# EAGLE design ESP_SIM7000V1.62 (EAGLE 9.6.2)
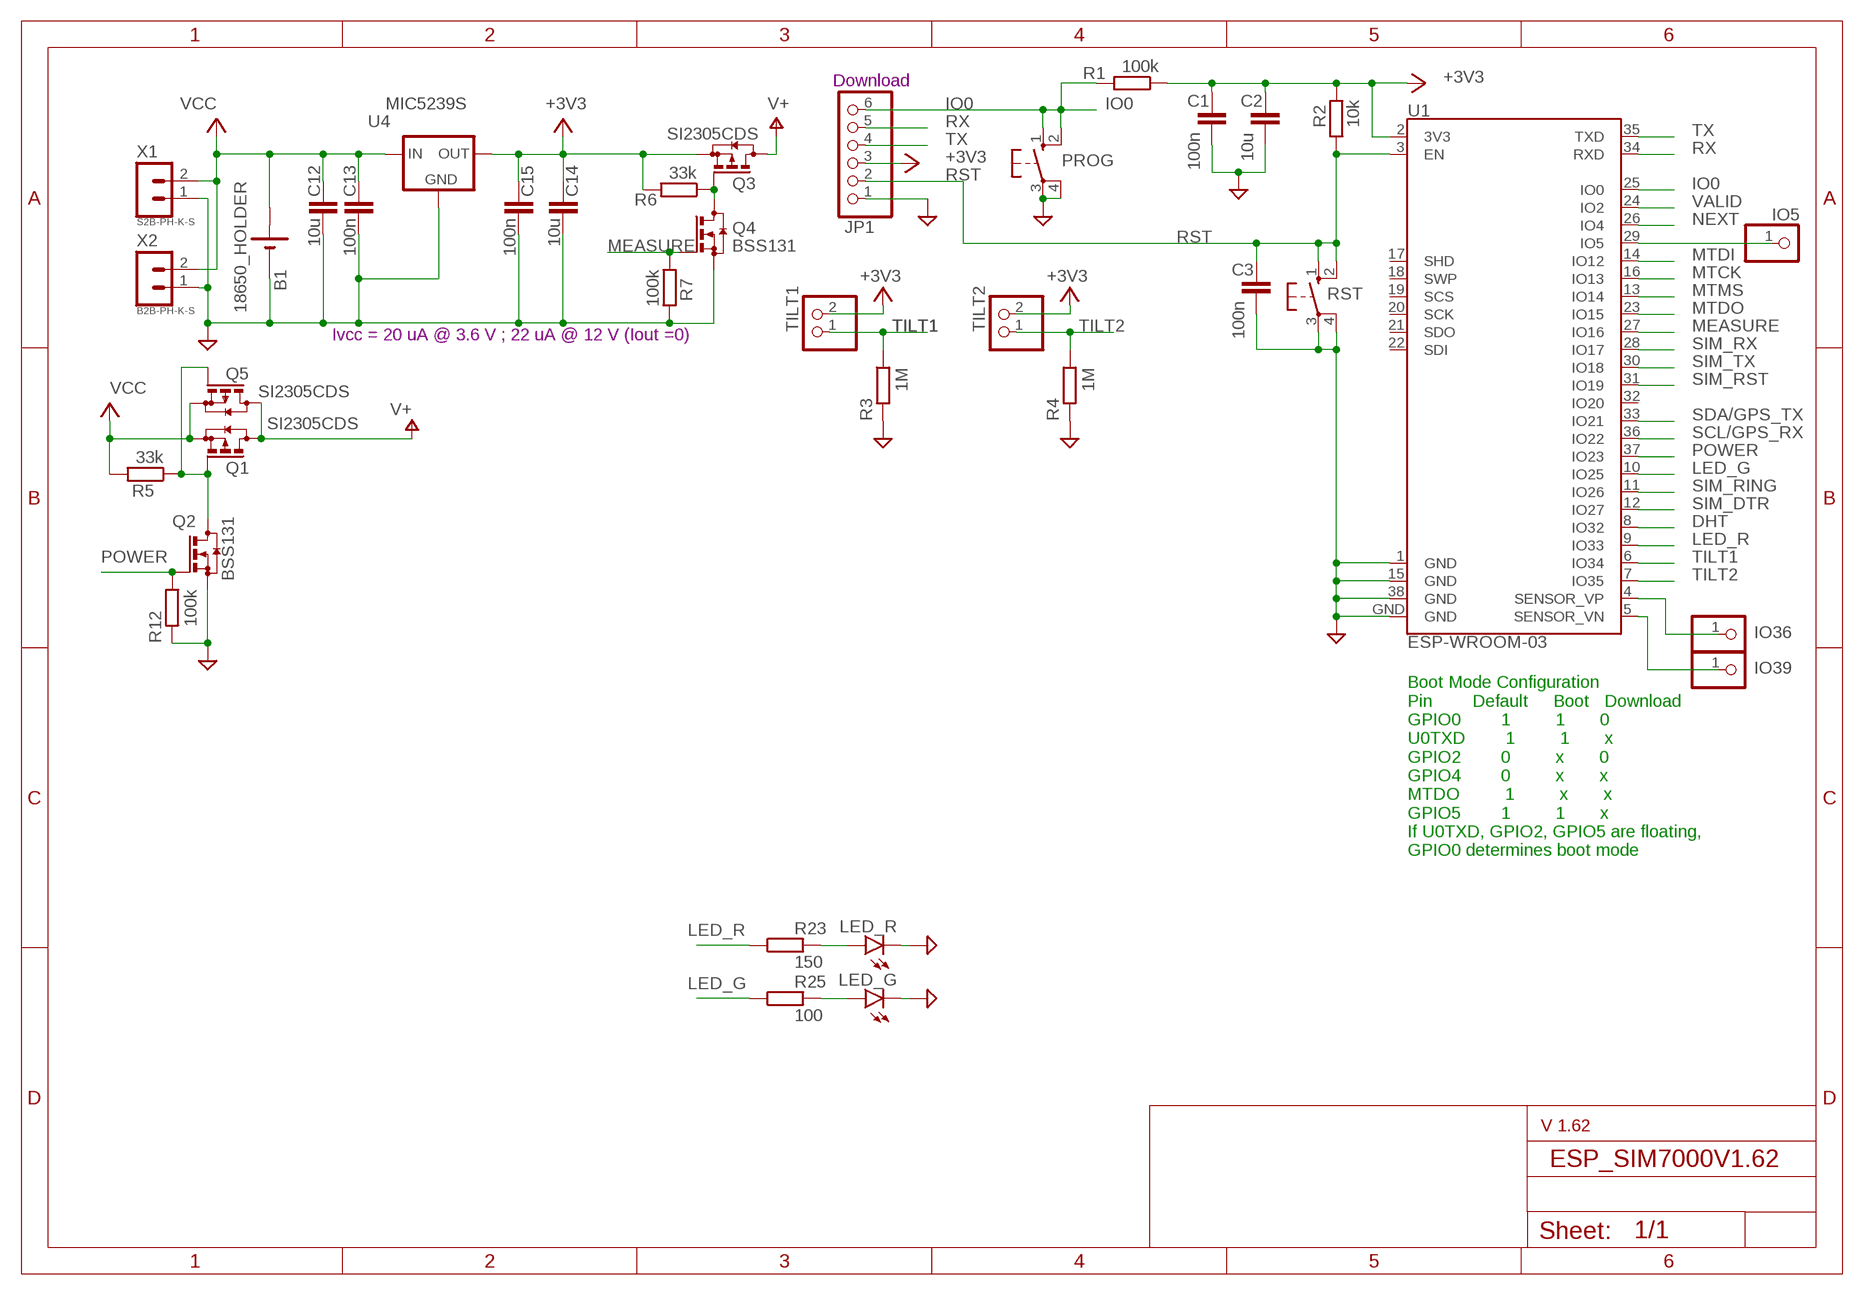
[diagram p0: schematic, sheet 1]

## Parts
B1  18650_HOLDER  [18650]
C1  100n  CC1206  [C1206]
C2  10u  CC1210  [C1210]
C3  100n  CC1206  [C1206]
C12  10u  CC1210  [C1210]
C13  100n  CC1206  [C1206]
C14  10u  CC1210  [C1210]
C15  100n  CC1206  [C1206]
IO5  PINHD-1X1  [1X01]
IO36  PINHD-1X1  [1X01]
IO39  PINHD-1X1  [1X01]
JP1  PINHD-1X6  [1X06]
LED_G  LEDSMT1206  [1206]
LED_R  LEDSMT1206  [1206]
PROG  10-XX  [B3F-10XX]
Q1  SI2305CDS  [SOT23]
Q2  BSS131  [SOT23]
Q3  SI2305CDS  [SOT23]
Q4  BSS131  [SOT23]
Q5  SI2305CDS  [SOT23]
R1  100k  RR1206  [R1206]
R2  10k  RR1206  [R1206]
R3  1M  RR1206  [R1206]
R4  1M  RR1206  [R1206]
R5  33k  RR1206  [R1206]
R6  33k  RR1206  [R1206]
R7  100k  RR1206  [R1206]
R12  100k  RR1206  [R1206]
R23  150  RR1206  [R1206]
R25  100  RR1206  [R1206]
RST  10-XX  [B3F-10XX]
TILT1  PINHD-1X2  [1X02]
TILT2  PINHD-1X2  [1X02]
U1  ESP-WROOM-03  [ESP-WROOM-03]
U4  MIC5239S  [SOT223]
X1  S2B-PH-K-S  [S2B-PH-K-S]
X2  B2B-PH-K-S  [B2B-PH-K-S]

## Nets
+3V3: C1.1 C2.1 C14.1 C15.1 JP1.3 Q3.2(S) R1.1 R2.2 R6.2 TILT1.2 TILT2.2 U1.2(3V3) U4.3(OUT)
DHT: U1.8(IO32)
GND: B1.- C1.2 C2.2 C3.2 C12.2 C13.2 C14.2 C15.2 JP1.1 LED_G.C LED_R.C PROG.3(P) PROG.4(P1) Q2.2(S) Q4.2(S) R3.2 R4.2 R7.2 R12.2 RST.3(P) RST.4(P1) U1.1(GND) U1.15(GND) U1.38(GND) U1.GND U4.2(GND) U4.4(GND) X1.1 X2.1
IO0: JP1.6 PROG.1(S) PROG.2(S1) R1.2 U1.25(IO0)
IO36: IO36.1 U1.4(SENSOR_VP)
IO39: IO39.1 U1.5(SENSOR_VN)
LED_G: R25.1 U1.10(IO25)
LED_R: R23.1 U1.9(IO33)
MEASURE: Q4.1(G) R7.1 U1.27(IO16)
MTCK: U1.16(IO13)
MTDI: U1.14(IO12)
MTDO: U1.23(IO15)
MTMS: U1.13(IO14)
N$1: Q1.1(G) Q2.3(D) Q5.1(G) R5.1
N$2: Q3.1(G) Q4.3(D) R6.1
N$7: LED_R.A R23.2
N$8: LED_G.A R25.2
N$17: IO5.1 U1.29(IO5)
NEXT: U1.26(IO4)
POWER: Q2.1(G) R12.1 U1.37(IO23)
RST: C3.1 JP1.2 R2.1 RST.1(S) RST.2(S1) U1.3(EN)
RX: JP1.5 U1.34(RXD)
SCL/GPS_RX: U1.36(IO22)
SDA/GPS_TX: U1.33(IO21)
SIM_DTR: U1.12(IO27)
SIM_RING: U1.11(IO26)
SIM_RST: U1.31(IO19)
SIM_RX: U1.28(IO17)
SIM_TX: U1.30(IO18)
TILT1: R3.1 TILT1.1 U1.6(IO34)
TILT2: R4.1 TILT2.1 U1.7(IO35)
TX: JP1.4 U1.35(TXD)
V+: Q1.3(D) Q3.3(D) Q5.3(D)
VALID: U1.24(IO2)
VCC: B1.+ C12.1 C13.1 Q1.2(S) Q5.2(S) R5.2 U4.1(IN) X1.2 X2.2
Unconnected: U1.17(SHD) U1.18(SWP) U1.19(SCS) U1.20(SCK) U1.21(SDO) U1.22(SDI) U1.32(IO20)

## Notes on the sheet
- Download
- Ivcc = 20 uA @ 3.6 V ; 22 uA @ 12 V (Iout =0)
- Boot Mode Configuration
  Pin        Default     Boot   Download
  GPIO0        1         1       0
  U0TXD        1         1       x
  GPIO2        0         x       0
  GPIO4        0         x       x
  MTDO         1         x       x
  GPIO5        1         1       x
  If U0TXD, GPIO2, GPIO5 are floating, 
  GPIO0 determines boot mode
- V 1.62

## Library data of the parts
B1 = battery_bms:18650_HOLDER: 18650 holder
C1-C3 C12-C15 = eagle-ltspice:C: CAPACITOR, European symbol; SPICEMODEL: NONE; SPICEPREFIX: C
IO5 IO36 IO39 = pinhead:PINHD-1X1: PIN HEADER
JP1 = pinhead:PINHD-1X6: PIN HEADER
LED_G LED_R = led:LED: LED OSRAM: - CHIPLED LG R971, LG N971, LY N971, LG Q971, LY Q971, LO R971, LY R971 LH N974, LH R974 LS Q976, LO Q976, LY Q976 LO Q996 - Hyper CHIPLED LW Q18S LB Q993, LB Q99A, LB R99A - SideLED LS A670, LO A670, LY A670, LG A670, LP A670 LB A673, LV A673, LT A673, LW A673 LH A674 LY A675 LS A676, LA A676, LO A676, LY A676, LW A676 LS A679, LY A679, LG A679 - Hyper Micro SIDELED® LS Y876, LA Y876, LO Y876, LY Y876 LT Y87S - SmartLED LW L88C, LW L88S LB L89C, LB L89S, LG L890 LS L89K, LO L89K, LY L89K LS L896, LA L896, LO L896, LY L896 - TOPLED LS T670, LO T670, LY T670, LG T670, LP T670 LSG T670, LSP T670, LSY T670, LOP T670, LYG T670 LG T671, LOG T671, LSG T671 LB T673, LV T673, LT T673, LW T673 LH T674 LS T676, LA T676, LO T676, LY T676, LB T676, LH T676, LSB T676, LW T676 LB T67C, LV T67C, LT T67C, LS T67K, LO T67K, LY T67K, LW E67C LS E67B, LA E67B, LO E67B, LY E67B, LB E67C, LV E67C, LT E67C LW T67C LS T679, LY T679, LG T679 LS T770, LO T770, LY T770, LG T770, LP T770 LB T773, LV T773, LT T773, LW T773 LH T774 LS E675, LA E675, LY E675, LS T675 LS T776, LA T776, LO T776, LY T776, LB T776 LHGB T686 LT T68C, LB T68C - Hyper Mini TOPLED® LB M676 - Mini TOPLED Santana® LG M470 LS M47K, LO M47K, LY M47K Source: http://www.osram.convergy.de LUXEON: - LUMILED® LXK2-PW12-R00, LXK2-PW12-S00, LXK2-PW14-U00, LXK2-PW14-V00 LXK2-PM12-R00, LXK2-PM12-S00, LXK2-PM14-U00 LXK2-PE12-Q00, LXK2-PE12-R00, LXK2-PE12-S00, LXK2-PE14-T00, LXK2-PE14-U00 LXK2-PB12-K00, LXK2-PB12-L00, LXK2-PB12-M00, LXK2-PB14-N00, LXK2-PB14-P00, LXK2-PB14-Q00 LXK2-PR12-L00, LXK2-PR12-M00, LXK2-PR14-Q00, LXK2-PR14-R00 LXK2-PD12-Q00, LXK2-PD12-R00, LXK2-PD12-S00 LXK2-PH12-R00, LXK2-PH12-S00 LXK2-PL12-P00, LXK2-PL12-Q00, LXK2-PL12-R00 Source: www.luxeon.com KINGBRIGHT: KA-3528ASYC Source: www.kingbright.com
PROG RST = switch-omron:10-XX: OMRON SWITCH; MPN: B3F-1000; OC_FARNELL: 176432; OC_NEWARK: 36M3542
Q1 Q3 Q5 = transistor-small-signal-perso:SI2305CDS: P-CHANNEL MOS FET
Q2 Q4 = transistor-small-signal-perso:BSS131: N-CHANNEL MOS FET
R1-R7 R12 R23 R25 = eagle-ltspice:R: RESISTOR, European symbol; SPICEMODEL: NONE; SPICEPREFIX: R
TILT1 TILT2 = pinhead:PINHD-1X2: PIN HEADER
U1 = esp32-sparkfun (1):ESP-WROOM-03; OC_FARNELL: unknown
U4 = micrel:MIC5239S: LDO REGULATOR
X1 = con-JST PH:S2B-PH: JST PH series header 2.00mm pitch disconnectable crimp style connectors, horizontal (side entry type), 2 pins
X2 = con-JST PH:B2B-PH: JST PH series header 2.00mm pitch disconnectable crimp style connectors, vertical (side entry type), 2 pins

## Board
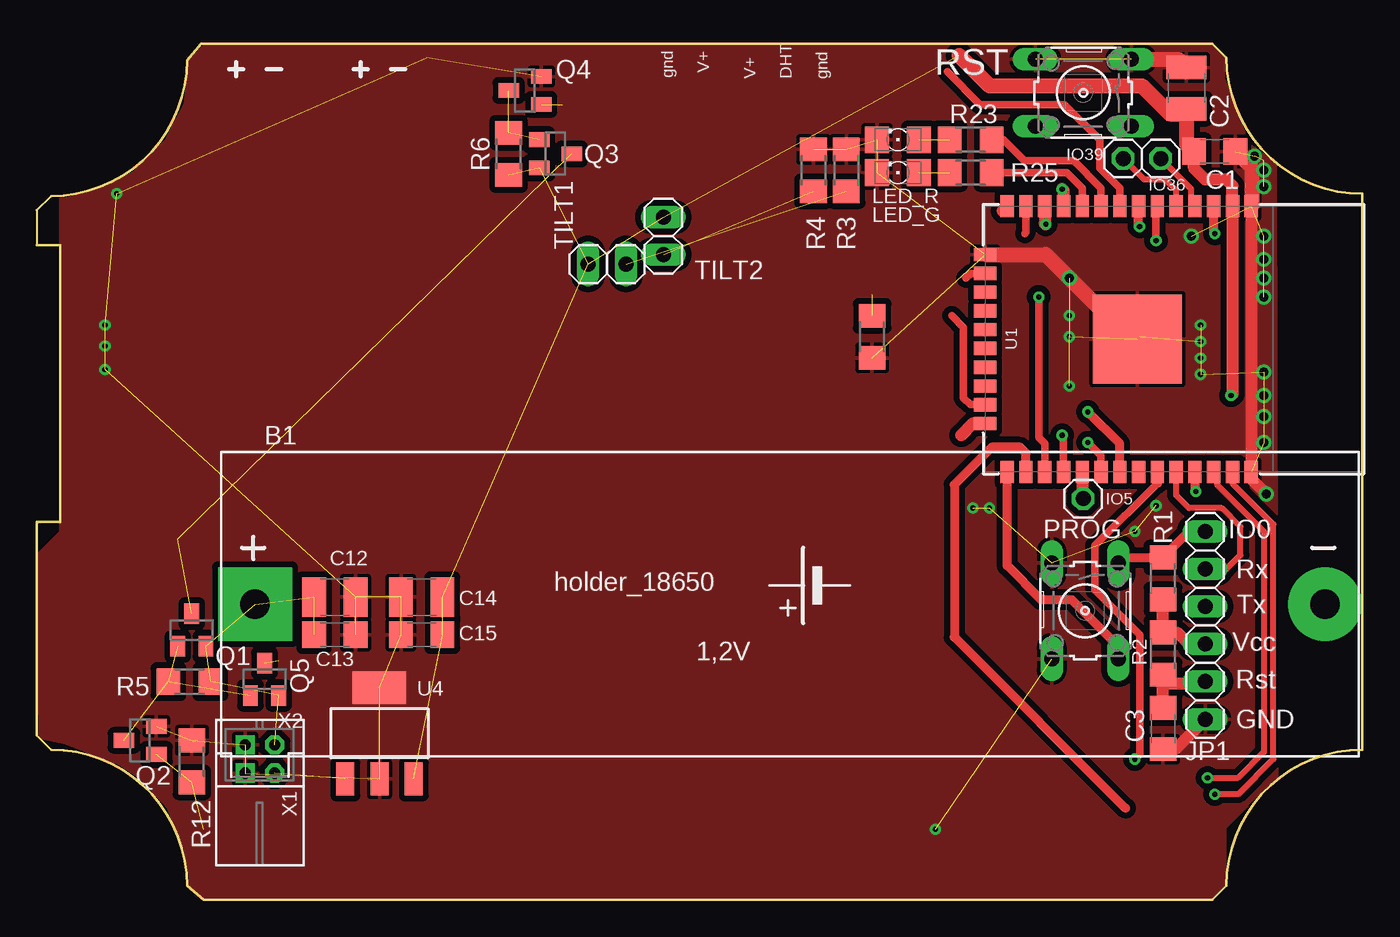
[diagram p1: board, top side]
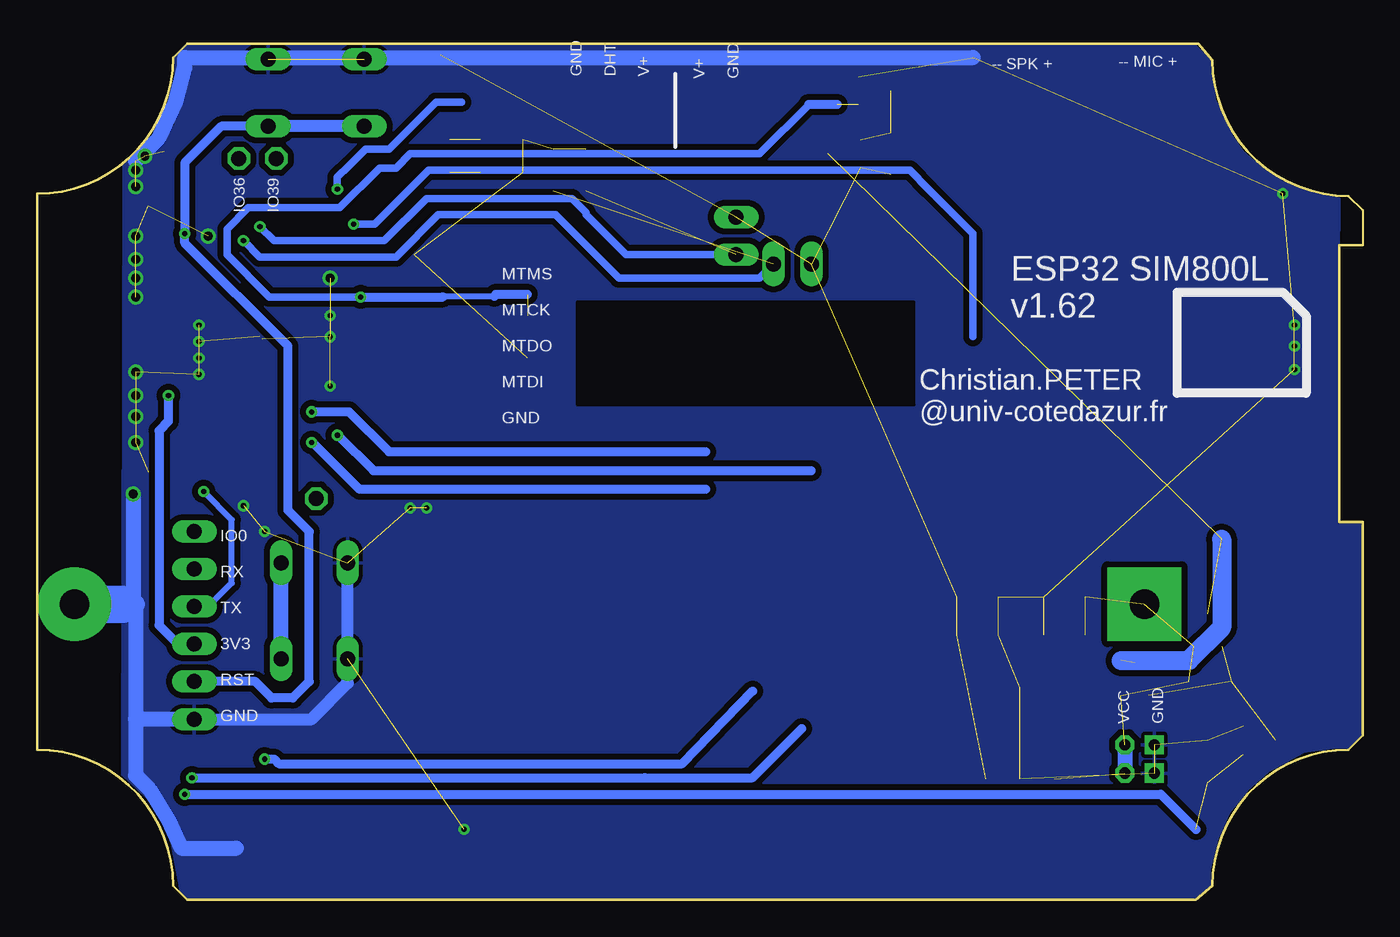
[diagram p2: board, bottom side, seen from below]

Size 89.69 x 57.94 mm. Coordinates in mm from the lower left corner, seen from the top.
Outline: 0.95,10.16 arc-90 10.16,0.95
Outline: 10.16,0.95 11.27,0 79.53,0 80.49,0.95 arc-90 89.69,10.16 89.69,47.78 arc-90 80.49,56.99 79.53,57.94 11.11,57.94 10.16,56.83 arc-90 0.95,47.62 0,46.67 0,44.29 1.59,44.29 1.59,25.56 0,25.56 0,11.11 0.95,10.16
Outline: 0.95,10.16 arc-90 10.16,0.95
Copper layers (1*16): Top 0.035mm / dielectric 1.5mm / Bottom 0.035mm
Design rules "default *": minimum track width 6mil, minimum drill 0.35mm, track to track 6mil, track to pad 6mil, pad to pad 6mil, via to via 6mil, smd to smd 6mil, copper to edge 0mil, drill to drill 6mil, minimum pad ring 10mil, minimum via ring 8mil, stop-mask expansion 4mil, vias tented up to drill 0mil, thermal gap 10mil

### Footprints (pad centres in the part's own frame; a part is rotated, then mirrored left to right if it is on the bottom)
18650 = drill 2 pad 5 square: + -36.2,0 | drill 2 pad 5: - 36.2,0
C1206 = smd 1.6 x 1.8: 1 -1.4,0; 2 1.4,0
C1210 = smd 1.6 x 2.7: 1 -1.4,0; 2 1.4,0
1X01 = drill 1.016 octagon: 1 0,0
1X06 = drill 1.016 long: 1 -6.35,0; 2 -3.81,0; 3 -1.27,0; 4 1.27,0; 5 3.81,0; 6 6.35,0
1206 = smd 1.6 x 1.803: A -1.422,0; C 1.422,0
B3F-10XX = drill 1.016 long: 1 -3.251,2.261; 2 3.251,2.261; 3 -3.251,-2.261; 4 3.251,-2.261
SOT23 = smd 1 x 1.4: 1 -0.95,-1.1; 2 0.95,-1.1; 3 0,1.1
R1206 = smd 1.6 x 1.803: 1 -1.422,0; 2 1.422,0
1X02 = drill 1.016 long: 1 -1.27,0; 2 1.27,0
ESP-WROOM-03 = smd 0.9 x 1.5: 1 7.7,9; 2 6.43,9; 3 5.16,9; 4 3.89,9; 5 2.62,9; 6 1.35,9; 7 0.08,9; 8 -1.19,9; 9 -2.46,9; 10 -3.73,9; 11 -5,9; 12 -6.27,9; 13 -7.54,9; 14 -8.81,9; 25 -8.81,-9; 26 -7.54,-9; 27 -6.27,-9; 28 -5,-9; 29 -3.73,-9; 30 -2.46,-9; 31 -1.19,-9; 32 0.08,-9; 33 1.35,-9; 34 2.62,-9; 35 3.89,-9; 36 5.16,-9; 37 6.43,-9; 38 7.7,-9 | smd 1.5 x 0.9: 15 -10.3,5.715; 16 -10.3,4.445; 17 -10.3,3.175; 18 -10.3,1.905; 19 -10.3,0.635; 20 -10.3,-0.635; 21 -10.3,-1.905; 22 -10.3,-3.175; 23 -10.3,-4.445; 24 -10.3,-5.715 | smd 6 x 6: GND 0,0
SOT223 = smd 1.219 x 2.235: 1 -2.311,-3.099; 2 0,-3.099; 3 2.311,-3.099 | smd 3.6 x 2.2: 4 0,3.099
S2B-PH-K-S = drill 0.75 pad 1.3 square: 1 1,0 | drill 0.75 pad 1.3 octagon: 2 -1,0
B2B-PH-K-S = drill 0.75 pad 1.3 square: 1 1,0 | drill 0.75 pad 1.3 octagon: 2 -1,0

### Placement (x,y rotation side)
B1  50.96,20 0 top
C1  79.69,50.64 0 top
C2  77.79,54.93 90 top
C3  76.2,11.59 270 top
C12  20.16,20.48 0 top
C13  20.16,17.94 0 top
C14  26.04,20.48 180 top
C15  26.04,17.94 180 top
IO5  70.8,27.15 0 top
IO36  76.04,50.16 0 top
IO39  73.5,50.16 90 top
JP1  79.06,18.57 90 top
LED_G  58.26,49.21 180 top
LED_R  58.26,51.44 180 top
PROG  70.93,19.56 270 top
Q1  10.48,18.26 0 top
Q2  6.98,10.79 90 top
Q3  35.08,50.48 270 top
Q4  33.02,54.77 90 top
Q5  15.4,14.92 0 top
R1  76.2,21.75 90 top
R2  76.2,16.67 90 top
R3  54.77,49.37 90 top
R4  52.55,49.37 90 top
R5  10.32,14.76 0 top
R6  31.91,50.48 270 top
R7  56.52,38.1 270 top
R12  10.48,9.37 90 top
R23  63.18,51.44 180 top
R25  63.18,49.21 180 top
RST  70.8,54.61 180 top
TILT1  38.58,43.02 180 top
TILT2  42.39,44.93 90 top
U1  74.46,37.95 0 top
U4  23.18,11.27 0 top
X1  15.08,8.57 180 top
X2  15.08,10.48 180 top

### Tracks (layer width: path | path; a pad name or v marks a point on that pad's centre or on a via)
+3V3  (via drill 0.35)  (7 unrouted)
  Top 0.813: JP1.3 77.95,17.3 77.16,18.09 R2.2 R1.1 | C1.1 78.29,49.5 79.06,48.74 80.49,48.74 80.89,48.33 U1.2 80.89,34.22 v80.8,34.13
  Top 1.016: 62.39,57.15 64.45,55.09 74.77,55.09 76.68,53.18 77.44,53.18 C2.1 77.79,51.15 C1.1
  Bottom 0.61: JP1.3 80.17,17.3 81.44,18.57 81.44,31.75 80.8,32.38 v80.8,34.13
DHT
  Top 0.508: U1.8 73.27,48.17 71.91,49.53 71.91,51.44 69.53,53.82 63.82,53.82 61.6,56.04
GND  (via drill 0.35, 0.6)  (48 unrouted)
  Top 0.61: U1.GND 74.62,38.1
  Top 0.813: v83.19,27.46 82.16,28.49 U1.38 U1.1 82.21,46.99 82.23,46.99 | C3.2 77.02,10.19 JP1.1
  Top 1.016: U1.15 68.26,43.66 73.82,38.1 74.31,38.1 U1.GND | 82.23,46.99 82.23,49.5 C1.2 | RST.3 77.24,56.87 C2.2
  Bottom 0.813: RST.3 74.17,56.99 | JP1.1 71.12,12.22 68.67,14.67 PROG.4 PROG.3
  Bottom 1.016: v83.19,27.46 83.19,20 | 83.03,20 83.03,12.22 | 83.03,12.22 83.03,8.41 82.07,7.46 80.8,5.4 79.94,3.49 76.2,3.49 | 83.03,50.01 81.44,51.59 80.33,53.97 79.69,56.3 79.69,56.99 67.67,56.99 RST.4 67.43,56.99 53.18,56.99 42.55,56.99 26.35,56.99 | JP1.1 83.03,12.22
  Bottom 1.27: 83.98,20 83.19,20 83.03,20
  Bottom 2.54: B1.- 83.98,20
  other vias: 83.03,43.34 83.03,35.72 83.03,42.07 83.03,30.96 83.03,44.93 83.03,40.8 83.03,34.13 83.03,32.7 69.85,42.07 4.6,35.88 4.6,37.47 4.6,38.89 69.85,39.53 69.85,38.1 69.85,34.77 5.4,47.78 64.45,26.51 63.34,26.51 60.8,4.76 83.03,48.26 78.11,44.93 82.39,50.32 83.03,49.37 74.3,24.92 75.72,26.67 78.74,38.89 78.74,37.78 78.74,36.67 78.74,35.56
  pour Top (isolate 0.406): 11.27,0 10.32,0.79 10.32,1.75 10,3.49 8.89,6.19 6.98,8.25 5.56,9.21 1.94,10.6 0.18,10.95 0.07,23.4 1.59,24.92 1.59,47.47 1.9,47.47 4.76,48.26 6.51,49.21 8.73,51.44 10,53.82 10.32,56.83 11.27,57.79 79.53,57.79 80.33,56.99 80.33,55.56 81.98,51.18 83.82,49.81 83.93,8.33 81.9,6.43 81.9,6.33 80.41,4.85 80.41,1.04 79.38,0
  pour Bottom (isolate 0.406): 11.27,0 10.32,0.95 10.32,2.06 9.84,4.13 9.05,5.87 7.78,7.46 6.35,8.73 3.97,10 1.75,10.32 0.95,10.32 0.16,11.11 0,25.4 1.75,25.4 1.59,47.47 3.65,47.94 5.4,48.58 6.83,49.53 8.1,50.64 8.89,51.75 10,54.13 10.32,56.83 11.27,57.79 79.53,57.79 80.33,56.99 80.33,52.41 83.82,49.81 83.93,8.45 81.21,5.89 81.21,5.32 80.79,4.91 79.98,0.61 79.38,0
  cutout Bottom: 30.32,40.48 53.18,40.48 53.18,33.5 30.32,33.5
IO0
  Top 0.61: 65.56,28.86 U1.25 65.65,22.61 67.95,20.32 70.01,20.32 73.19,17.14 PROG.2 | PROG.1 73.55,23.17 R1.2 77.95,24.92 JP1.6
  Bottom 1.016: PROG.2 PROG.1
IO36
  Top 0.406: U1.4 78.35,47.38 78.11,47.62 78.11,48.1 IO36.1
IO39
  Top 0.406: U1.5 77.08,48.01 76.36,48.74 74.93,48.74 IO39.1
LED_G
  Top 0.508: R25.1 69.69,49.21 70.73,48.17 U1.10
LED_R
  Top 0.508: U1.9 72,48.17 70.17,50.01 66.83,50.01 65.4,51.44 R23.1
MEASURE  (via drill 0.35)  (2 unrouted)
  Top 0.508: U1.27 68.19,30.87 67.79,31.27 v67.79,40.8
  Bottom 0.406: 58.74,40.85 62.18,40.85 62.23,40.8
  Bottom 0.508: 37.46,53.82 40.8,50.48 64.45,50.48 65.41,49.53 66.52,49.53 69.22,46.83 75.41,46.83 76.84,45.4 76.84,43.66 73.98,40.8 v67.79,40.8
  Bottom 0.61: 35.56,53.82 37.46,53.82 | 56.52,40.96 58.63,40.96 58.74,40.85 | v67.79,40.8 62.23,40.8
MTCK
  Top 0.508: U1.16 63.19,42.39 62.87,42.07
MTDI
  Top 0.813: U1.14 65.34,46.63
MTDO
  Top 0.508: U1.23 63.18,33.5 62.71,33.97 62.71,38.73 61.91,39.53
MTMS
  Top 0.508: 66.83,45.08 66.92,45.18 U1.13
N$1  (3 unrouted)
N$2  (2 unrouted)
N$7  (1 unrouted)
N$8  (1 unrouted)
N$17
  Top 0.813: U1.29 70.73,27.21 IO5.1
NEXT
  Top 0.61: U1.26 66.92,30.23 66.52,30.64 64.61,30.64 62.07,28.1 62.07,17.78 73.66,6.19
POWER  (via drill 0.35)  (2 unrouted)
  Top 0.406: v79.69,7.14 81.28,7.14 83.66,9.53 83.66,25.4 80.89,28.17 U1.37
  Bottom 0.61: v79.69,7.14 13.65,7.14 11.27,4.76
RST  (via drill 0.35)
  Top 0.61: v79.69,45.08 79.62,45.15 U1.3
  Top 0.813: C3.1 76.2,14.6 | 76.2,14.6 R2.1 | JP1.2 78.9,14.6 76.2,14.6
  Bottom 0.61: JP1.2 74.93,14.76 73.82,13.65 72.39,13.65 71.28,14.76 71.28,24.92 72.71,26.35 72.71,37.47 79.69,44.45 v79.69,45.08 79.69,49.89 77.23,52.35 RST.1
  Bottom 0.813: RST.2 RST.1
RX
  Top 0.406: JP1.5 80.49,22.38 81.44,23.34 81.44,25.24 80.17,26.51 77.95,26.51 77.08,27.37 U1.34
SCL/GPS_RX  (via drill 0.35)
  Top 0.406: v79.22,8.25 81.28,8.25 83.03,10 83.03,24.92 79.85,28.1 79.85,28.72 U1.36
  Bottom 0.61: v79.22,8.25 48.58,8.25 41.28,8.25 37.94,11.59
SDA/GPS_TX  (via drill 0.35)
  Top 0.508: 75.81,28.19 71.6,23.97 71.6,20.96 74.61,17.94 74.61,9.84 v74.3,9.53
  Top 0.61: 75.81,28.63 75.97,28.79 U1.33 75.81,28.19
  Bottom 0.61: v74.3,9.53 73.66,9.53 73.34,9.21 46.04,9.21 41.28,14.13
SIM_DTR  (via drill 0.35)
  Top 0.813: U1.12 68.19,45.79 v68.26,45.72
  Bottom 0.508: 26.35,38.1 26.35,45.08 29.37,48.1 30.64,49.37 63.18,49.37 66.83,45.72 v68.26,45.72
SIM_RING  (via drill 0.35)
  Top 0.813: v69.37,48.1 69.46,48.01 U1.11
  Bottom 0.508: v69.37,48.1 69.37,48.9 68.58,49.69 67.47,50.8 65.88,50.8 62.71,53.97 60.96,53.97
SIM_RST  (via drill 0.35)
  Top 0.61: U1.31 73.27,30.87 v71.12,33.02
  Bottom 0.61: 44.45,30.32 65.88,30.32 68.58,33.02 v71.12,33.02
SIM_RX  (via drill 0.35)
  Top 0.508: U1.28 69.46,31.43 v69.37,31.43
  Bottom 0.61: v69.37,31.43 69.3,31.43 66.92,29.05 37.31,29.05
SIM_TX  (via drill 0.35)
  Top 0.508: U1.30 72,30.07 v71.12,30.96
  Bottom 0.61: 44.45,27.78 67.86,27.78 71.03,30.96 v71.12,30.96
TILT1  (via drill 0.35)  (1 unrouted)
  Top 0.508: v75.72,44.61 75.72,46.86 U1.6
  Bottom 0.508: v75.72,44.61 74.61,43.5 65.41,43.5 62.55,46.36 54.61,46.36 50.32,42.07 40.8,42.07 TILT1.1
TILT2  (via drill 0.35)  (1 unrouted)
  Top 0.61: v74.61,45.56 74.54,45.63 U1.7
  Bottom 0.508: v74.61,45.56 73.66,44.61 66.2,44.61 63.34,47.47 53.5,47.47 52.55,46.51 52.55,46.36 49.85,43.66 TILT2.1
TX  (via drill 0.35)
  Top 0.61: U1.35 78.35,27.69 v78.42,27.62
  Bottom 0.406: JP1.4 78.11,19.84 76.52,21.43 76.52,25.72 v78.42,27.62
V+  (3 unrouted)
  Bottom 1.27: 16.35,16.19 11.75,16.19 9.53,18.42 9.53,24.42
VALID
  Top 0.61: 64.01,32.38 U1.24
  Top 0.813: U1.24 63.35,32.23 62.54,31.43
VCC  (7 unrouted)
  Bottom 1.016: X2.2 X1.2

### Text on the board
tNames: gnd / / V+ | V+ / / DHT / / gnd | IO0 | Rx | Tx | Vcc | Rst | GND
bNames: -- MIC + | -- SPK + | V+ / / GND | GND / / DHT / / V+ | IO36 / / IO39 | ESP32 SIM800L / v1.62 | Christian.PETER / @univ-cotedazur.fr | MTMS / / MTCK / / MTDO / / MTDI / / GND | IO0 / / RX / / TX / / 3V3 / / RST / / GND | VCC / / GND